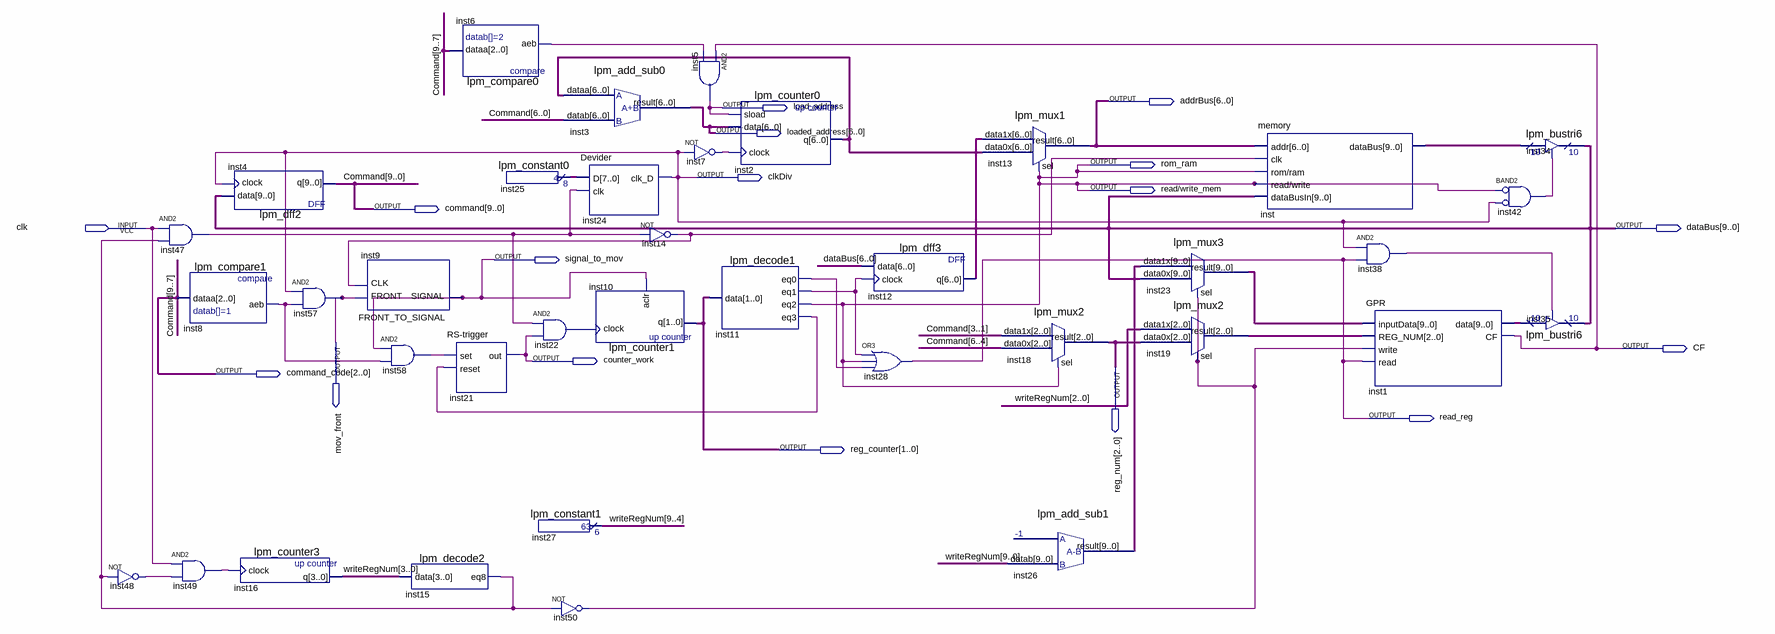
[diagram p0: schematic sheet]
// Quartus schematic reserv.bdf as structural Verilog: 37 symbols, 17 pins
module reserv (
  input  clk,
  output [6:0] addrBus,
  output load_address,
  output [6:0] loaded_address,
  output rom_ram,
  output clkDiv,
  output \read/write_mem ,
  output [9:0] command,
  output [9:0] dataBus,
  output signal_to_mov,
  output mov_front,
  output CF,
  output counter_work,
  output [2:0] reg_num,
  output [2:0] command_code,
  output read_reg,
  output [1:0] reg_counter
);

  wire inst6_aeb, inst7_out, inst8_aeb, inst11_eq0, inst11_eq1, inst11_eq3, inst14_out, inst15_eq8,
       inst22_out, inst38_out, inst42_out, inst47_out, inst48_out, inst49_out, inst50_out, inst58_out;
  wire [2:0] inst19_result;
  wire [6:0] inst2_q, inst12_q;
  wire [7:0] inst25_result;
  wire [9:0] inst1_data, inst23_result, inst26_result, inst_databus, writeRegNum;

  not inst48 (inst48_out, inst15_eq8);
  and inst47 (inst47_out, clk, inst15_eq8);
  lpm_compare1 inst8 (.dataa(command[9:7]), .aeb(inst8_aeb));
  and inst49 (inst49_out, clk, inst48_out);
  lpm_dff2 inst4 (.data(dataBus), .clock(clkDiv), .q(command));
  lpm_counter3 inst16 (.clock(inst49_out), .q(writeRegNum[3:0]));
  and inst57 (mov_front, clkDiv, inst8_aeb);
  FRONT_TO_SIGNAL inst9 (.FRONT(mov_front), .CLK(inst14_out), .SIGNAL(signal_to_mov));
  and inst58 (inst58_out, signal_to_mov, inst8_aeb);
  lpm_decode2 inst15 (.data(writeRegNum[3:0]), .eq8(inst15_eq8));
  lpm_compare0 inst6 (.dataa(command[9:7]), .aeb(inst6_aeb));
  \RS-trigger  inst21 (.set(inst58_out), .reset(inst11_eq3), .out(counter_work));
  lpm_constant0 inst25 (.result(inst25_result));
  lpm_add_sub0 inst3 (.dataa(inst2_q), .datab(command[6:0]), .result(loaded_address));
  and inst22 (inst22_out, inst47_out, counter_work);
  lpm_constant1 inst27 (.result(writeRegNum[9:4]));
  not inst50 (inst50_out, inst15_eq8);
  Devider inst24 (.D(inst25_result), .clk(inst47_out), .clk_D(clkDiv));
  lpm_counter1 inst10 (.clock(inst22_out), .aclr(signal_to_mov), .q(reg_counter));
  not inst14 (inst14_out, inst47_out);
  and inst5 (load_address, CF, inst6_aeb);
  not inst7 (inst7_out, clkDiv);
  lpm_decode1 inst11 (.data(reg_counter), .eq0(inst11_eq0), .eq1(inst11_eq1), .eq2(\read/write_mem ), .eq3(inst11_eq3));
  lpm_counter0 inst2 (.sload(load_address), .data(loaded_address), .clock(inst7_out), .q(inst2_q));
  lpm_dff3 inst12 (.data(dataBus[6:0]), .clock(inst11_eq1), .q(inst12_q));
  or inst28 (read_reg, inst11_eq1, \read/write_mem , inst11_eq0);
  lpm_mux1 inst13 (.data1x(inst12_q), .data0x(inst2_q), .sel(\read/write_mem ), .result(addrBus));
  lpm_mux2 inst18 (.data1x(command[3:1]), .data0x(command[6:4]), .sel(\read/write_mem ), .result(reg_num));
  lpm_add_sub1 inst26 (.datab(writeRegNum), .result(inst26_result));
  lpm_mux3 inst23 (.data1x(inst26_result), .data0x(dataBus), .sel(inst50_out), .result(inst23_result));
  lpm_mux2 inst19 (.data1x(writeRegNum[2:0]), .data0x(reg_num), .sel(inst50_out), .result(inst19_result));
  memory inst (
    .addr(addrBus), .clk(inst14_out), .\rom/ram (\read/write_mem ), .\read/write (\read/write_mem ),
    .dataBusIn(dataBus), .dataBus(inst_databus));
  and inst38 (inst38_out, clkDiv, read_reg);
  GPR inst1 (
    .inputData(inst23_result), .REG_NUM(inst19_result), .write(inst50_out), .read(read_reg),
    .data(inst1_data), .CF(CF));
  lpm_bustri6 inst34 (.enabledt(inst42_out), .data(inst_databus), .tridata(dataBus));
  and inst42 (inst42_out, ~\read/write_mem , ~clkDiv);  // BAND2
  lpm_bustri6 inst35 (.enabledt(inst38_out), .data(inst1_data), .tridata(dataBus));

  assign command_code = command[9:7];
  assign rom_ram = \read/write_mem ;
endmodule
